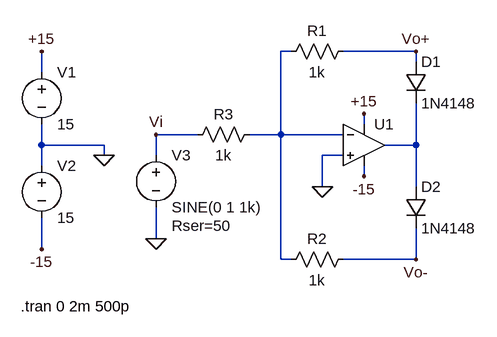
[diagram p0: schematic SeparadorDePolaridad.asc]
SeparadorDePolaridad.asc, the LTspice schematic file:
Version 4
SHEET 1 880 680
WIRE 80 32 64 32
WIRE 272 32 160 32
WIRE 272 48 272 32
WIRE -304 64 -304 32
WIRE 192 144 192 128
WIRE -64 160 -128 160
WIRE 64 160 64 32
WIRE 64 160 16 160
WIRE 160 160 64 160
WIRE -304 176 -304 144
WIRE -208 176 -304 176
WIRE 272 176 272 112
WIRE 272 176 224 176
WIRE -208 192 -208 176
WIRE -128 192 -128 160
WIRE 160 192 128 192
WIRE -304 208 -304 176
WIRE 192 224 192 208
WIRE 128 240 128 192
WIRE 272 240 272 176
WIRE -128 320 -128 272
WIRE -304 336 -304 288
WIRE 64 352 64 160
WIRE 80 352 64 352
WIRE 272 352 272 304
WIRE 272 352 160 352
FLAG 128 240 0
FLAG -208 192 0
FLAG -304 32 +15
FLAG -304 336 -15
FLAG 192 128 +15
FLAG 192 224 -15
FLAG -128 320 0
FLAG 272 32 Vo+
FLAG 272 352 Vo-
FLAG -128 160 Vi
SYMBOL OpAmps\\UniversalOpAmp 192 176 R0
SYMATTR InstName U1
SYMBOL diode 256 48 R0
SYMATTR InstName D1
SYMATTR Value 1N4148
SYMBOL diode 256 240 R0
SYMATTR InstName D2
SYMATTR Value 1N4148
SYMBOL res 176 16 R90
WINDOW 0 0 56 VBottom 2
WINDOW 3 32 56 VTop 2
SYMATTR InstName R1
SYMATTR Value 1k
SYMBOL res 176 336 R90
WINDOW 0 0 56 VBottom 2
WINDOW 3 32 56 VTop 2
SYMATTR InstName R2
SYMATTR Value 1k
SYMBOL voltage -304 48 R0
WINDOW 123 0 0 Left 0
WINDOW 39 0 0 Left 0
SYMATTR InstName V1
SYMATTR Value 15
SYMBOL voltage -304 192 R0
WINDOW 123 0 0 Left 0
WINDOW 39 0 0 Left 0
SYMATTR InstName V2
SYMATTR Value 15
SYMBOL voltage -128 176 R0
WINDOW 123 0 0 Left 0
WINDOW 39 24 124 Left 2
SYMATTR SpiceLine Rser=50
SYMATTR InstName V3
SYMATTR Value SINE(0 1 1k)
SYMBOL res 32 144 R90
WINDOW 0 0 56 VBottom 2
WINDOW 3 32 56 VTop 2
SYMATTR InstName R3
SYMATTR Value 1k
TEXT -336 424 Left 2 !.tran 0 2m 500p

The netlist it stands for:
* SeparadorDePolaridad.asc
XU1 0 N001 +15 -15 N002 level1 Avol=1Meg GBW=10Meg Vos=0 En=0 Enk=0 In=0 Ink=0 Rin=500Meg  ; pins In+ In- V+ V- OUT
D1 Vo+ N002 1N4148
D2 N002 Vo- 1N4148
R1 Vo+ N001 1k
R2 Vo- N001 1k
V1 +15 0 15
V2 0 -15 15
V3 Vi 0 SINE(0 1 1k) Rser=50
R3 N001 Vi 1k
.model D D
.lib standard.dio
.tran 0 2m 500p
.lib UniversalOpAmp1.lib
.backanno
.end